# Altium project MPPT_Charger_NB_IoT.PrjPcb
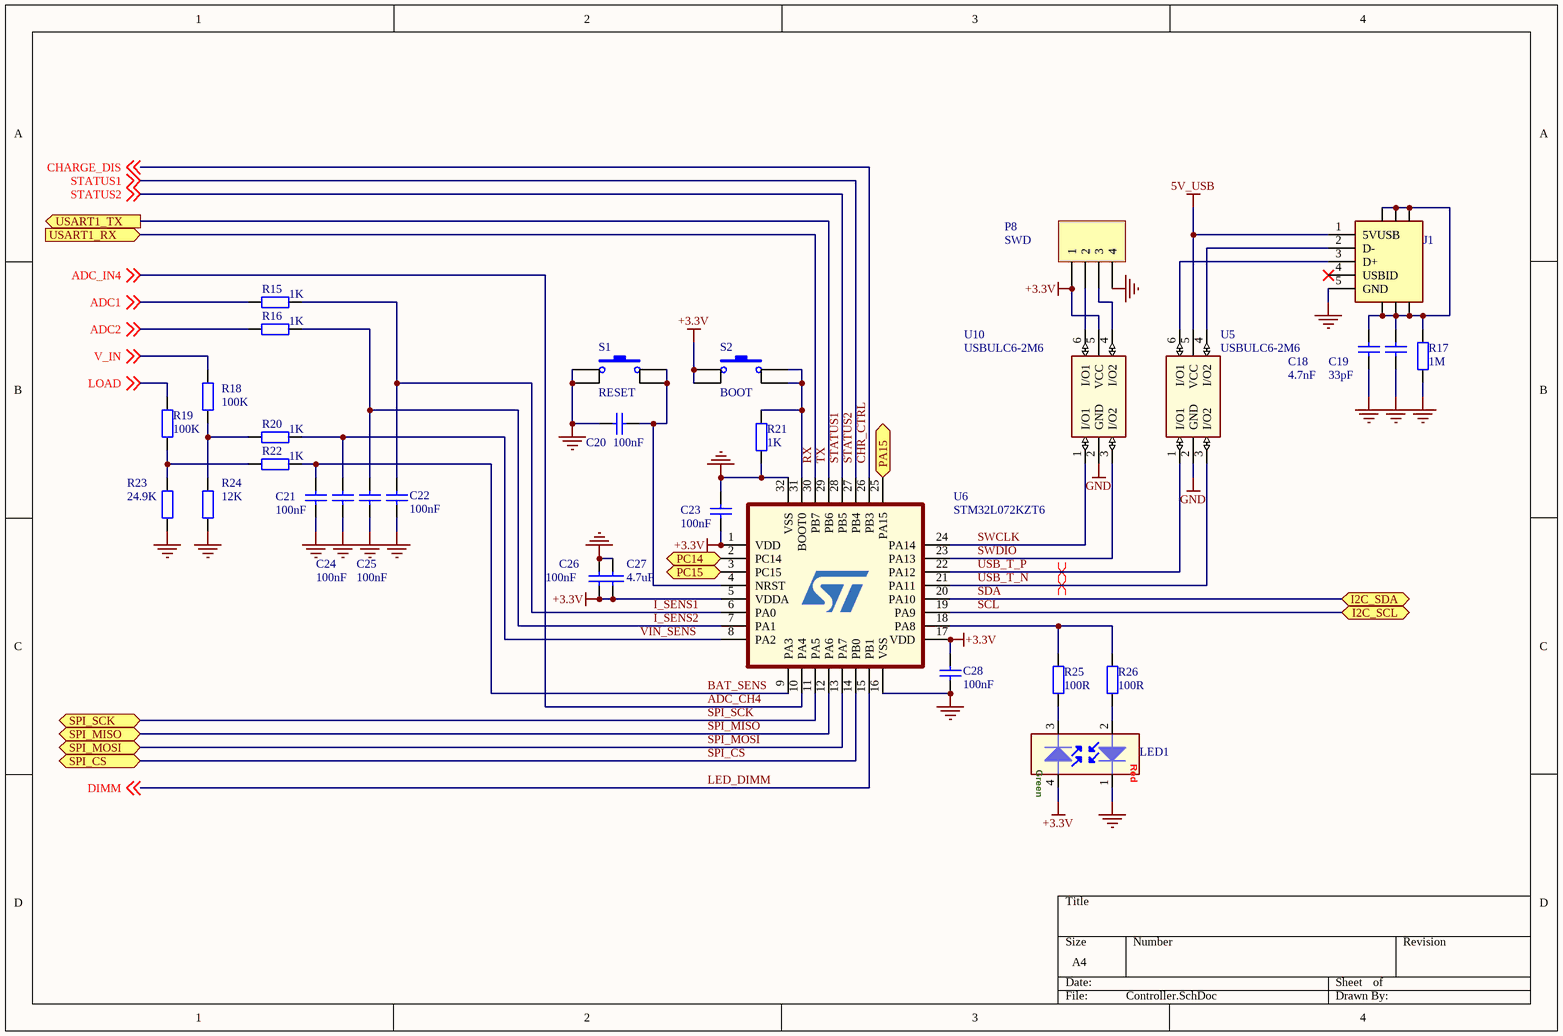
[diagram p0: Controller.SchDoc]
5 sheets, 113 parts. Net scope: flat (ports and power ports of the same name join across sheets).
Board file: MPPT_Charger.PcbDoc
Sheets:
  Controller.SchDoc
  Charger.SchDoc
  LED Driver.SchDoc
  Arduino.SchDoc
  Power.SchDoc

## Sheet Controller.SchDoc
size A4

### Parts
C18  value 4.7nF  [C0402]  (hidden comment: Capacitor ceramic)
C19  value 33pF  [C0402]  (hidden comment: Capacitor ceramic)
C20  value 100nF  [C0402]  (hidden comment: Capacitor ceramic)
C21  value 100nF  [C0402]  (hidden comment: Capacitor ceramic)
C22  value 100nF  [C0402]  (hidden comment: Capacitor ceramic)
C23  value 100nF  [C0402]  (hidden comment: Capacitor ceramic)
C24  value 100nF  [C0402]  (hidden comment: Capacitor ceramic)
C25  value 100nF  [C0402]  (hidden comment: Capacitor ceramic)
C26  value 100nF  [C0402]  (hidden comment: Capacitor ceramic)
C27  value 4.7uF  [C0805]  (hidden comment: Capacitor ceramic)
C28  value 100nF  [C0402]  (hidden comment: Capacitor ceramic)
J1  CON-000116-01  [10118192-0001LF]  (value not drawn)
LED1  LED_BICOLOR  [PLCC-4]  (value not drawn)
P8  SWD  [HDR1X4]  (no BOM)
R15  value 1K  [R0402]  (hidden comment: Resistor)
R16  value 1K  [R0402]  (hidden comment: Resistor)
R17  value 1M  [R0402]  (hidden comment: Resistor)
R18  value 100K  [R0402]  (hidden comment: Resistor)
R19  value 100K  [R0402]  (hidden comment: Resistor)
R20  value 1K  [R0402]  (hidden comment: Resistor)
R21  value 1K  [R0402]  (hidden comment: Resistor)
R22  value 1K  [R0402]  (hidden comment: Resistor)
R23  value 24.9K  [R0402]  (hidden comment: Resistor)
R24  value 12K  [R0402]  (hidden comment: Resistor)
R25  value 100R  [R0402]  (hidden comment: Resistor)
R26  value 100R  [R0402]  (hidden comment: Resistor)
S1  RESET  [EVQPUA]
S2  BOOT  [EVQPUA]
U5  USBULC6-2M6  [Micro_QFN_6L]
U6  STM32L072KZT6  [LQFP32]
U10  USBULC6-2M6  [Micro_QFN_6L]

### Ports
I2C_SCL (bidir), I2C_SDA (bidir), PA15 (bidir), PC14 (bidir), PC15 (bidir), SPI_CS (bidir), SPI_MISO (bidir), SPI_MOSI (bidir), SPI_SCK (bidir), USART1_RX (in), USART1_TX (out)

### Nets
5V_USB: J1.1(5VUSB) U5.5(VCC)
+3.3V: C23.2 C26.2 C27.1 C28.1 LED1.4 P8.1 S2.1 S2.3 U6.1(VDD) U6.5(VDDA) U6.17(VDD) U10.5(VCC)
GND: C18.1 C19.1 C20.2 C21.2 C22.2 C23.1 C24.2 C25.2 C26.1 C27.2 C28.2 J1.5(GND) LED1.1 P8.4 R17.1 R21.1 R23.2 R24.1 S1.1 S1.3 U5.2(GND) U6.16(VSS) U6.32(VSS) U10.2(GND)
V_IN: R18.2 ; off-sheet V_IN
ADC1: R15.1 ; off-sheet ADC1
ADC2: R16.1 ; off-sheet ADC2
ADC_CH4: U6.10(PA4) ; off-sheet ADC_IN4  [also labelled ADC_IN4]
BAT_SENS: C21.1 R22.2 U6.9(PA3)
CHR_CTRL: U6.26(PB3) ; off-sheet CHARGE_DIS  [also labelled CHARGE_DIS]
I_SENS1: C22.1 R15.2 U6.6(PA0)
I_SENS2: C25.1 R16.2 U6.7(PA1)
LED_DIMM: U6.15(PB1) ; off-sheet DIMM  [also labelled DIMM]
LOAD: R19.1 ; off-sheet LOAD  [project net SR_N]
RX: U6.30(PB7) ; port USART1_RX
SCL: U6.19(PA9) ; port I2C_SCL
SDA: U6.20(PA10) ; port I2C_SDA
SPI_CS: U6.14(PB0) ; port SPI_CS
SPI_MISO: U6.12(PA6) ; port SPI_MISO
SPI_MOSI: U6.13(PA7) ; port SPI_MOSI
SPI_SCK: U6.11(PA5) ; port SPI_SCK
STATUS1: U6.27(PB4) U6.28(PB5) ; off-sheet STATUS1, off-sheet STATUS2  [also labelled STATUS2]
SWCLK: U6.24(PA14) U10.1(I/O1)
SWDIO: U6.23(PA13) U10.3(I/O2)
TX: U6.29(PB6) ; port USART1_TX
USB_T_N: U5.3(I/O2) U6.21(PA11)
USB_T_P: U5.1(I/O1) U6.22(PA12)
VIN_SENS: C24.1 R20.2 U6.8(PA2)
NetC18_2: C18.2 C19.2 J1.6 J1.7 J1.8 J1.9 J1.10 J1.11 R17.2
NetC20_1: C20.1 S1.2 S1.4 U6.4(NRST)
NetJ1_2: J1.2(D-) U5.4(I/O2)
NetJ1_3: J1.3(D+) U5.6(I/O1)
NetLED1_2: LED1.2 R26.2
NetLED1_3: LED1.3 R25.2
NetP4_3: U6.25(PA15) ; port PA15
NetP4_4: U6.3(PC15) ; port PC15
NetP4_5: U6.2(PC14) ; port PC14
NetP8_2: P8.2 U10.6(I/O1)
NetP8_3: P8.3 U10.4(I/O2)
NetR18_1: R18.1 R20.1 R24.2
NetR19_2: R19.2 R22.1 R23.1
NetR21_2: R21.2 S2.2 S2.4 U6.31(BOOT0)
NetR25_1: R25.1 R26.1 U6.18(PA8)

Not connected (* = marked no-connect by the designer): J1 4(USBID)*

### Layout directives
differential pair: USB_T_N, USB_T_P

### Notes on the sheet
- (in symbol LED_BICOLOR) Red; Green

### Library data of the parts
C18 = Cap Semi: Manufacturer: Yageo; Manufacturer Part No.: AC0402KRX7R9BB472; Part Description: Ceramic Capacitor; Specification: X7R, 50V, 10%; Supplier: DigiKey; Supplier part number: 311-3030-1-ND; Link: https://www.digikey.com/product-detail/en/yageo/AC0402KRX7R9BB472/311-3030-1-ND/6643281
C19 = Cap Semi: Manufacturer: Yageo; Manufacturer Part No.: CC0402JRNPO9BN330; Part Description: Ceramic Capacitor; Specification: NP0, 50V, 5%; Supplier: DigiKey; Supplier part number: 311-1020-1-ND; Link: https://www.digikey.com/product-detail/en/yageo/CC0402JRNPO9BN330/311-1020-1-ND/302937
C20 = Cap Semi: Manufacturer: TDK Corporation; Manufacturer Part No.: CGA2B3X7R1V104K050BB; Part Description: Ceramic Capacitor; Specification: X7R, 35V, 10%; Supplier: DigiKey; Supplier part number: 445-6901-1-ND; Link: https://www.digikey.com/product-detail/en/tdk-corporation/CGA2B3X7R1V104K050BB/445-6901-1-ND/2672919
C21-C26 C28 = Cap: Manufacturer: TDK Corporation; Manufacturer Part No.: CGA2B3X7R1V104K050BB; Part Description: Ceramic Capacitor; Specification: X7R, 35V, 10%; Link: https://www.digikey.com/product-detail/en/tdk-corporation/CGA2B3X7R1V104K050BB/445-6901-1-ND/2672919; Supplier: DigiKey; Supplier part number: 445-6901-1-ND
C27 = Cap Semi: Manufacturer: Murata Electronics; Manufacturer Part No.: GRM219R6YA475KA73D; Part Description: Ceramic Capacitor; Specification: X5R, 35V, 10%; Supplier: DigiKey; Supplier part number: 490-7208-1-ND; Link: https://www.digikey.com/product-detail/en/murata-electronics/GRM219R6YA475KA73D/490-7208-1-ND/3900454
J1 = CON-000116-01: Manufacturer: Amphenol ICC (FCI); Part Description: Micro USB Connector; Specification: Type B; Value: 10118192-0001LF; Manufacturer Part No.: 10118192-0001LF; Supplier: DigiKey; Supplier part number: 609-4613-1-ND; Link: https://www.digikey.com/product-detail/en/amphenol-icc-fci/10118192-0001LF/609-4613-1-ND/2785378
LED1 = LED_BICOLOR: Manufacturer: OSRAM Opto Semiconductors Inc.; Manufacturer Part No.: LSG T67K-JL-1+HK-1; Part Description: BICOLOR LED RED/GREEN CLEAR; Specification: SMT; Value: LSG T67K-JL-1+HK-1; Link: https://www.digikey.com/product-detail/en/osram-opto-semiconductors-inc/LSG-T67K-JL-1-HK-1/475-3435-1-ND/7908051; Supplier: DigiKey; Supplier part number: 475-3435-1-ND
P8 = Header 4: Header, 4-Pin; Manufacturer: Samtec Inc.; Manufacturer Part No.: SLW-104-01-G-S; Part Description: Receptacle Connector Through Hole; Specification: 4 pos. 2.54mm; Value: SLW-104-01-G-S; Link: https://www.digikey.com/products/en?keywords=SLW-104-01-G-S; Supplier: DigiKey; Supplier part number: SAM1089-04-ND
R15 R16 R20-R22 = Res2: Manufacturer: Yageo; Manufacturer Part No.: AC0402JR-071KL; Part Description: Thick Film Resistor; Specification: 5% 0,063W; Link: https://www.digikey.com/product-detail/en/yageo/AC0402JR-071KL/YAG3525CT-ND/6006374; Supplier: DigiKey; Supplier part number: YAG3525CT-ND
R17 = Res2: Manufacturer: Yageo; Manufacturer Part No.: RC0402FR-071ML; Part Description: Thick Film Resistor; Specification: 1% 0,063W; Supplier: DigiKey; Supplier part number: 311-1.00MLRCT-ND; Link: https://www.digikey.com/product-detail/en/yageo/RC0402FR-071ML/311-1-00MLRCT-ND/729462
R18 R19 = Res2: Manufacturer: Yageo; Manufacturer Part No.: RC0402JR-07100KL; Part Description: Thick Film Resistor; Specification: 5% 0,063W; Link: https://www.digikey.com/product-detail/en/yageo/RC0402JR-07100KL/311-100KJRCT-ND/729363; Supplier: DigiKey; Supplier part number: 311-100KJRCT-ND
R23 = Res2: Manufacturer: Yageo; Manufacturer Part No.: RC0402FR-0724K9L; Part Description: Thick Film Resistor; Specification: 1% 0,063W; Link: https://www.digikey.com/product-detail/en/yageo/RC0402FR-0724K9L/311-24-9KLRCT-ND/729514; Supplier: DigiKey; Supplier part number: 311-24.9KLRCT-ND
R24 = Res2: Manufacturer: Yageo; Manufacturer Part No.: RC0402JR-0712KL; Part Description: Thick Film Resistor; Specification: 5% 0,063W; Link: https://www.digikey.com/product-detail/en/yageo/RC0402JR-0712KL/311-12KJRCT-ND/729370; Supplier: DigiKey; Supplier part number: 311-12KJRCT-ND
R25 R26 = Res2: Manufacturer: Yageo; Manufacturer Part No.: SR0402JR-7W100RL; Part Description: Thick Film Resistor; Specification: 5% 0.125W; Supplier: DigiKey; Supplier part number: YAG6156CT-ND; Link: https://www.digikey.com/product-detail/en/yageo/SR0402JR-7W100RL/YAG6156CT-ND/9696610
S1 S2 = SW-PB: Switch; Manufacturer: Panasonic; Manufacturer Part No.: EVQPUJ02K; Part Description: Tactile Button; Specification: 1.6N, Right Angle, 50mA; Value: EVQPUJ02K; Supplier: DigiKey; Supplier part number: P10851SCT-ND; Link: https://www.digikey.com/product-detail/en/panasonic-electronic-components/EVQ-PUJ02K/P10851SCT-ND/286352
U5 U10 = USBULC6-2M6: Ultra large bandwidth ESD protection; Manufacturer: STMicroelectronics; Specification: 6V, 0.6pF; Link: https://www.digikey.com/product-detail/en/stmicroelectronics/USBULC6-2M6/497-7044-1-ND/1880382; Manufacturer Part No.: USBULC6-2M6; Part Description: Ultra large bandwidth ESD protection; Supplier: DigiKey; Supplier part number: 497-7044-1-ND; Value: USBULC6-2M6
U6 = STM32L072KZT6: Ultra-low-power 32-bit MCU Arm®-based Cortex®-M0+; Manufacturer: STMicroelectronics; Specification: 192KB, 20KB, 1.65V-3.6V; Link: https://www.digikey.com/products/en?keywords=STM32L072KZT6; Manufacturer Part No.: STM32L072KZT6; Part Description: Ultra-low-power 32-bit MCU Arm®-based Cortex®-M0+; Supplier: DigiKey; Supplier part number: 497-19668-ND; Value: STM32L072KZT6

## Sheet Charger.SchDoc
size A4
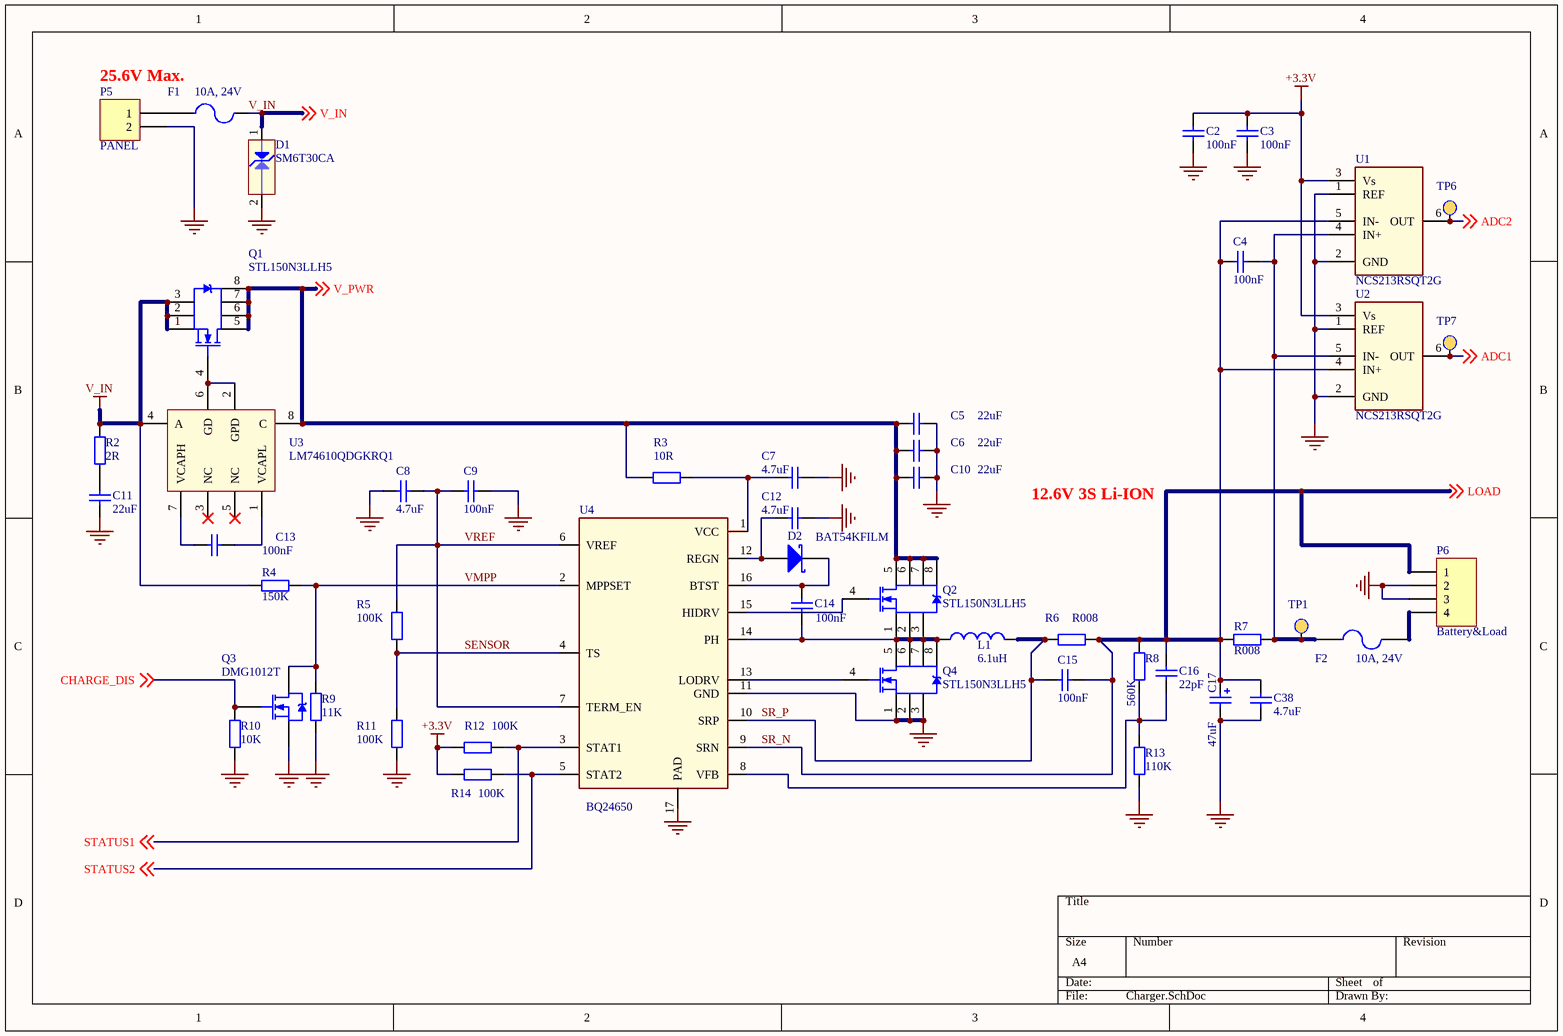
[diagram p1: Charger.SchDoc]

### Parts
C2  value 100nF  [C0402]  (hidden comment: Capacitor ceramic)
C3  value 100nF  [C0402]  (hidden comment: Capacitor ceramic)
C4  value 100nF  [C0402]  (hidden comment: Capacitor ceramic)
C5  value 22uF  [C1210]  (hidden comment: Capacitor ceramic)
C6  value 22uF  [C1210]  (hidden comment: Capacitor ceramic)
C7  value 4.7uF  [C0805]  (hidden comment: Capacitor ceramic)
C8  value 4.7uF  [C0805]  (hidden comment: Capacitor ceramic)
C9  value 100nF  [C0402]  (hidden comment: Capacitor ceramic)
C10  value 22uF  [C1210]  (hidden comment: Capacitor ceramic)
C11  value 22uF  [C1210]  (hidden comment: Capacitor ceramic)
C12  value 4.7uF  [C0805]  (hidden comment: Capacitor ceramic)
C13  value 100nF  [C0402]  (hidden comment: Capacitor ceramic)
C14  value 100nF  [C0402]  (hidden comment: Capacitor ceramic)
C15  value 100nF  [C0402]  (hidden comment: Capacitor ceramic)
C16  value 22pF  [C0402]  (hidden comment: Capacitor ceramic)
C17  value 47uF  [EIA-7343-31]  (hidden comment: Capacitor Tantalum)
C38  value 4.7uF  [C0805]  (hidden comment: Capacitor ceramic)
D1  SM6T30CA  [DO-214AA]
D2  BAT54KFILM  [SOD-523]
F1  10A, 24V  [F1206]
F2  10A, 24V  [F1206]
L1  value 6.1uH  [CDEP147]  (hidden comment: Power Inductor)
P5  PANEL  [TERM2pin5mm]
P6  Battery&Load  [TERM4pin5mm]
Q1  STL150N3LLH5  [PowerFLAT 5x6]
Q2  STL150N3LLH5  [PowerFLAT 5x6]
Q3  DMG1012T  [SOT-523_custom]
Q4  STL150N3LLH5  [PowerFLAT 5x6]
R2  value 2R  [R0805]  (hidden comment: Resistor)
R3  value 10R  [R0805]  (hidden comment: Resistor)
R4  value 150K  [R0402]  (hidden comment: Resistor)
R5  value 100K  [R0402]  (hidden comment: Resistor)
R6  value R008  [R2010]  (hidden comment: Resistor)
R7  value R008  [R2010]  (hidden comment: Resistor)
R8  value 560K  [R0402]  (hidden comment: Resistor)
R9  value 11K  [R0402]  (hidden comment: Resistor)
R10  value 10K  [R0402]  (hidden comment: Resistor)
R11  value 100K  [R0402]  (hidden comment: Resistor)
R12  value 100K  [R0402]  (hidden comment: Resistor)
R13  value 110K  [R0402]  (hidden comment: Resistor)
R14  value 100K  [R0402]  (hidden comment: Resistor)
TP1  Test_Point  [TEST_POINT]  (value not drawn)  (no BOM)
TP6  Test_Point  [TEST_POINT]  (value not drawn)  (no BOM)
TP7  Test_Point  [TEST_POINT]  (value not drawn)  (no BOM)
U1  NCS213RSQT2G  [SOT-363]
U2  NCS213RSQT2G  [SOT-363]
U3  LM74610QDGKRQ1  [TSSOP-8]
U4  BQ24650  [QFN-16_custom]

### Nets
+3.3V: C2.1 C3.1 R12.1 R14.1 U1.3(Vs) U2.3(Vs)
GND: C2.2 C3.2 C5.1 C6.1 C7.1 C8.1 C9.1 C10.1 C11.2 C12.1 C17.2 C38.2 D1.2(PIN2) P5.2 P6.2 P6.3 Q3.3(S) Q4.1(S) Q4.2(S) Q4.3(S) R9.1 R10.1 R11.1 R13.1 U1.1(REF) U1.2(GND) U2.1(REF) U2.2(GND) U4.11(GND) U4.17(PAD)
V_IN: D1.1(PIN1) F1.2 Q1.1(S) Q1.2(S) Q1.3(S) R2.2 R4.2 U3.4(A) ; off-sheet V_IN
ADC1: TP7.0 U2.6(OUT) ; off-sheet ADC1
ADC2: TP6.0 U1.6(OUT) ; off-sheet ADC2
CHARGE_DIS: Q3.1(G) R10.2 ; off-sheet CHARGE_DIS  [project net CHR_CTRL]
SENSOR: R5.1 R11.2 U4.4(TS)
SR_N: C4.2 C15.1 C16.1 C17.1 C38.1 P6.1 R6.2 R7.2 R8.2 U1.5(IN-) U2.4(IN+) U4.9(SRN) ; off-sheet LOAD  [also labelled LOAD]
SR_P: C15.2 L1.2 R6.1 U4.10(SRP)
STATUS1: R12.2 R14.2 U4.3(STAT1) U4.5(STAT2) ; off-sheet STATUS1, off-sheet STATUS2  [also labelled STATUS2]
V_PWR: C5.2 C6.2 C10.2 Q1.5(D) Q1.6(D) Q1.7(D) Q1.8(D) Q2.5(D) Q2.6(D) Q2.7(D) Q2.8(D) R3.1 U3.8(C) ; off-sheet V_PWR
VMPP: Q3.2(D) R4.1 R9.2 U4.2(MPPSET)
VREF: C8.2 C9.2 R5.2 U4.6(VREF) U4.7(TERM_EN)
NetC4_1: C4.1 F2.1 R7.1 TP1.0 U1.4(IN+) U2.5(IN-)
NetC7_2: C7.2 R3.2 U4.1(VCC)
NetC11_1: C11.1 R2.1
NetC12_2: C12.2 D2.1(A) U4.12(REGN)
NetC13_1: C13.1 U3.7(VCAPH)
NetC13_2: C13.2 U3.1(VCAPL)
NetC14_1: C14.1 D2.2(K) U4.16(BTST)
NetC14_2: C14.2 L1.1 Q2.1(S) Q2.2(S) Q2.3(S) Q4.5(D) Q4.6(D) Q4.7(D) Q4.8(D) U4.14(PH)
NetC16_2: C16.2 R8.1 R13.2 U4.8(VFB)
NetF1_1: F1.1 P5.1
NetF2_2: F2.2 P6.4
NetQ1_4: Q1.4(G) U3.2(GPD) U3.6(GD)
NetQ2_4: Q2.4(G) U4.15(HIDRV)
NetQ4_4: Q4.4(G) U4.13(LODRV)

Not connected (* = marked no-connect by the designer): U3 3(NC)* 5(NC)*

### Notes on the sheet
- 25.6V Max.
- 12.6V 3S Li-ION

### Library data of the parts
C2-C4 C9 C13-C15 = Cap: as C21 on sheet Controller; Link: https://www.digikey.com/product-detail/en/tdk-corporation/CGA2B3X7R1V104K050BB/445-6901-1-ND/2672919; Supplier: DigiKey; Supplier part number: 445-6901-1-ND
C5 C6 C10 C11 = Cap: Manufacturer: Taiyo Yuden; Manufacturer Part No.: GMK325BJ226MM-P; Part Description: Ceramic Capacitor; Specification: X5R, 35V, 20%; Link: https://www.digikey.com/product-detail/en/taiyo-yuden/GMK325BJ226MM-P/587-5853-1-ND/7674973; Supplier: DigiKey; Supplier part number: 587-5853-1-ND
C7 C8 C12 C38 = Cap: Manufacturer: Murata Electronics; Manufacturer Part No.: GRM219R6YA475KA73D; Part Description: Ceramic Capacitor; Specification: X5R, 35V, 10%; Link: https://www.digikey.com/product-detail/en/murata-electronics/GRM219R6YA475KA73D/490-7208-1-ND/3900454; Supplier: DigiKey; Supplier part number: 490-7208-1-ND
C16 = Cap: Manufacturer: Yageo; Manufacturer Part No.: CC0402JRNPO9BN220; Part Description: Ceramic Capacitor; Specification: NPO, 50V, 5%; Link: https://www.digikey.com/product-detail/en/yageo/CC0402JRNPO9BN220/311-1018-1-ND/302935; Supplier: DigiKey; Supplier part number: 311-1018-1-ND
C17 = Cap Pol2: Manufacturer: AVX Corporation; Manufacturer Part No.: TAJD476K016RNJ; Specification: TANT, 16V, 10%; Link: https://www.digikey.com/product-detail/en/avx-corporation/TAJD476K016RNJ/478-1739-1-ND/564771; Part Description: Capacitor Tantalum; Supplier: DigiKey; Supplier part number: 478-1739-1-ND
D1 = ESD_Diode: ESD Diode Symbol; Manufacturer: STMicroelectronics; Manufacturer Part No.: SM6T30CAY; Part Description: TVS DIODE; Specification: 30V, 0.6kW; Value: SM6T30CAY; Link: https://www.digikey.com/product-detail/en/stmicroelectronics/SM6T30CAY/497-10800-1-ND/2442951; Supplier: DigiKey; Supplier part number: 497-10800-1-ND
D2 = D Schottky: Schottky Diode; Manufacturer: STMicroelectronics; Part Description: Small signal Schottky diode; Specification: 40V, 0.3A; Manufacturer Part No.: BAT54KFILM; Supplier: DigiKey; Supplier part number: 497-5561-1-ND; Value: BAT54KFILM; Link: https://www.digikey.com/product-detail/en/stmicroelectronics/BAT54KFILM/497-5561-1-ND/1207053
F1 F2 = Fuse 2: SMD Fuse; Manufacturer: LITTELFUSE; Part Description: Fast Acting  Fuse; Value: 1206SFH100F/24-2; Specification: 100A; Link: https://uk.farnell.com/littelfuse/1206sfh100f-24-2/fuse-1206-10a/dp/1832124; Manufacturer Part No.: 1206SFH100F/24-2; Supplier: Farnell; Supplier part number: 1832124
L1 = Inductor: Manufacturer: Sumida America Components Inc.; Manufacturer Part No.: CDEP147NP-6R1MC-95; Specification: 11A, 20%; Link: https://www.digikey.com/product-detail/en/sumida-america-components-inc/CDEP147NP-6R1MC-95/308-1608-1-ND/3232383; Part Description: Power Inductor; Supplier: DigiKey; Supplier part number: 308-1608-1-ND
P5 = Header 2: Header, 2-Pin; Manufacturer: SAURO; Part Description: Terminal block; Value: MSG02001; Specification: 2pos. 5mm,  24A, 300V; Link: https://www.sauro.net/products/MSG02001/?product_id=MSG02001; Manufacturer Part No.: MSG02001; Supplier: Rutronik; Supplier part number: COTERM5720
P6 = Header 4: Header, 4-Pin; Manufacturer: SAURO; Manufacturer Part No.: MSG04001; Part Description: Terminal block; Specification: 4 pos. 5mm,  24A, 300V; Value: MSG04001; Link: https://www.sauro.net/products/MSG04001/?product_id=MSG04001; Supplier: Rutronik; Supplier part number: COTERM6351
Q1 Q2 Q4 = STL150N3LLH5: Power MOSFET N-channel; Manufacturer: STMicroelectronics; Part Description: P-channel Power MOSFET; Specification: 30V, 35A; Manufacturer Part No.: STL150N3LLH5; Supplier: Farnell; Supplier part number: 1752112RL; Value: STL150N3LLH5; Link: https://uk.farnell.com/stmicroelectronics/stl150n3llh5/mosfet-n-ch-30v-35a-powerflat6x5/dp/1752112RL
Q3 = NMOS-2: N-Channel Power MOSFET; Manufacturer: Diodes Incorporated; Manufacturer Part No.: DMG1012T-7; Part Description: N-Channel MOSFET; Specification: 20V, 0.63A; Value: DMG1012T-7; Supplier: DigiKey; Supplier part number: DMG1012T-7DICT-ND; Link: https://www.digikey.com/product-detail/en/diodes-incorporated/DMG1012T-7/DMG1012T-7DICT-ND/2181232
R2 = Res2: Manufacturer: Yageo; Manufacturer Part No.: RC0805JR-072RL; Part Description: Thick Film Resistor; Specification: 5% 0.125W; Link: https://www.digikey.com/product-detail/en/yageo/RC0805JR-072RL/311-2-0ARCT-ND/731214; Supplier: DigiKey; Supplier part number: 311-2.0ARCT-ND
R3 = Res2: Manufacturer: Yageo; Manufacturer Part No.: RC0805JR-07510RL; Part Description: Thick Film Resistor; Specification: 5% 0.125W; Link: https://www.digikey.com/product-detail/en/yageo/RC0805JR-07510RL/311-510ARCT-ND/731290; Supplier: DigiKey; Supplier part number: 311-510ARCT-ND
R4 = Res2: Manufacturer: Yageo; Manufacturer Part No.: RC0402JR-07150KL; Part Description: Thick Film Resistor; Specification: 5% 0,063W; Link: https://www.digikey.com/product-detail/en/yageo/RC0402JR-07150KL/311-150KJRCT-ND/729372; Supplier: DigiKey; Supplier part number: 311-150KJRCT-ND
R5 R11 R12 R14 = Res2: as R18 on sheet Controller; Link: https://www.digikey.com/product-detail/en/yageo/RC0402JR-07100KL/311-100KJRCT-ND/729363; Supplier: DigiKey; Supplier part number: 311-100KJRCT-ND
R6 R7 = Res2: Manufacturer: Rohm Semiconductor; Manufacturer Part No.: PMR50HZPFU8L00; Part Description: Thick Film Resistor; Specification: 1% 1W; Link: https://www.digikey.com/product-detail/en/rohm-semiconductor/PMR50HZPFU8L00/RHM-008ASCT-ND/2094542; Supplier: DigiKey; Supplier part number: RHM.008ASCT-ND
R8 = Res2: Manufacturer: Yageo; Manufacturer Part No.: RC0402JR-07560KL; Part Description: Thick Film Resistor; Specification: 5% 0,063W; Link: https://www.digikey.com/product-detail/en/yageo/RC0402JR-07560KL/311-560KJRCT-ND/729440; Supplier: DigiKey; Supplier part number: 311-560KJRCT-ND
R9 = Res2: Manufacturer: Yageo; Manufacturer Part No.: RC0402JR-0711KL; Part Description: Thick Film Resistor; Specification: 5% 0,063W; Link: https://www.digikey.com/product-detail/en/yageo/RC0402JR-0711KL/311-11KJRCT-ND/729367; Supplier: DigiKey; Supplier part number: 311-11KJRCT-ND
R10 = Res2: Manufacturer: Yageo; Manufacturer Part No.: RC0100JR-0710KL; Part Description: Thick Film Resistor; Specification: 5% 0.03W; Link: https://www.digikey.com/product-detail/en/yageo/RC0100JR-0710KL/311-10KDHCT-ND/2254412; Supplier: DigiKey; Supplier part number: 311-10KDHCT-ND
R13 = Res2: Manufacturer: Yageo; Manufacturer Part No.: RC0402JR-07110KL; Part Description: Thick Film Resistor; Specification: 5% 0,063W; Link: https://www.digikey.com/product-detail/en/yageo/RC0402JR-07110KL/311-110KJRCT-ND/729366; Supplier: DigiKey; Supplier part number: 311-110KJRCT-ND
TP1 TP6 TP7 = Test_Point: Test Point
U1 U2 = NCS21xR: Current-Shunt Monitor; Manufacturer: ON Semiconductor; Specification: x50, 80uA, 26V; Link: https://www.digikey.com/product-detail/en/on-semiconductor/NCS213RSQT2G/NCS213RSQT2GOSCT-ND/9169239; Manufacturer Part No.: NCS213RSQT2G; Part Description: Current-Shunt Monitor; Supplier: DigiKey; Supplier part number: NCS213RSQT2GOSCT-ND; Value: NCS213RSQT2G
U3 = LM74610-Q1: Smart Diode Controller; Manufacturer: TI; Specification: 42V, 30uA; Link: https://www.digikey.com/product-detail/en/texas-instruments/LM74610QDGKRQ1/296-43067-1-ND/5722225; Manufacturer Part No.: LM74610QDGKRQ1; Part Description: Smart Diode Controller; Supplier: DigiKey; Supplier part number: 296-43067-1-ND; Value: LM74610QDGKRQ1
U4 = BQ24650: Maximum Power Point Charger; Manufacturer: TI; Manufacturer Part No.: BQ24650RVAR; Part Description: Battery Charge Controller; Value: BQ24650RVAT; Specification: 28V, MPPT; Link: https://www.digikey.com/product-detail/en/texas-instruments/BQ24650RVAR/296-46287-1-ND/7033462; Supplier: DigiKey; Supplier part number: 296-46287-1-ND

## Sheet LED Driver.SchDoc
size A4
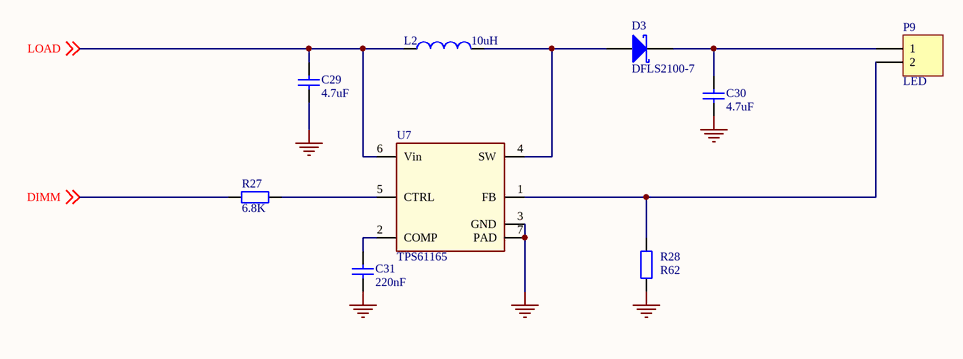
[diagram p2: LED Driver.SchDoc]

### Parts
C29  value 4.7uF  [C0805]  (hidden comment: Capacitor ceramic)
C30  value 4.7uF  [C0805]  (hidden comment: Capacitor ceramic)
C31  value 220nF  [C0402]  (hidden comment: Capacitor ceramic)
D3  DFLS2100-7  [PowerDI123]
L2  value 10uH  [LQH3NP]  (hidden comment: Power Inductor)
P9  LED  [TERM2pin5mm]
R27  value 6.8K  [R0402]  (hidden comment: Resistor)
R28  value R62  [R1206]  (hidden comment: Resistor)
U7  TPS61165  [QFN-6_custom]

### Nets
GND: C29.2 C30.2 C31.2 R28.1 U7.3(GND) U7.7(PAD)
DIMM: R27.1 ; off-sheet DIMM  [project net LED_DIMM]
LOAD: C29.1 L2.1 U7.6(Vin) ; off-sheet LOAD  [project net SR_N]
NetC30_1: C30.1 D3.2(K) P9.1
NetC31_1: C31.1 U7.2(COMP)
NetD3_1: D3.1(A) L2.2 U7.4(SW)
NetP9_2: P9.2 R28.2 U7.1(FB)
NetR27_2: R27.2 U7.5(CTRL)

### Library data of the parts
C29 C30 = Cap: as C7 on sheet Charger; Link: https://www.digikey.com/product-detail/en/murata-electronics/GRM219R6YA475KA73D/490-7208-1-ND/3900454; Supplier: DigiKey; Supplier part number: 490-7208-1-ND
C31 = Cap: Manufacturer: Yageo; Manufacturer Part No.: CC0402KRX5R8BB224; Part Description: Ceramic Capacitor; Specification: X5R, 25V, 10%; Link: https://www.digikey.com/product-detail/en/yageo/CC0402KRX5R8BB224/311-3341-1-ND/6818311; Supplier: DigiKey; Supplier part number: 311-3341-1-ND
D3 = D Schottky: Schottky Diode; Manufacturer: Diodes Incorporated; Part Description: DIODE SCHOTTKY; Specification: 100V, 2A; Link: https://www.digikey.com/product-detail/en/diodes-incorporated/DFLS2100-7/DFLS2100-7DICT-ND/3451552; Value: DFLS2100-7; Manufacturer Part No.: DFLS2100-7; Supplier: DigiKey; Supplier part number: DFLS2100-7DICT-ND
L2 = Inductor: Manufacturer: Murata Electronics; Manufacturer Part No.: LQH3NPN100MMEL; Specification: 0.8A, 20%; Link: https://www.digikey.com/product-detail/en/murata-electronics/LQH3NPN100MMEL/490-15945-1-ND/6800610; Part Description: Power Inductor; Supplier: DigiKey; Supplier part number: 490-15945-1-ND
P9 = Header 2: as P5 on sheet Charger; Link: https://www.sauro.net/products/MSG02001/?product_id=MSG02001; Manufacturer Part No.: MSG02001; Supplier: Rutronik; Supplier part number: COTERM5720
R27 = Res2: Manufacturer: Yageo; Manufacturer Part No.: RC0402JR-076K8L; Part Description: Thick Film Resistor; Specification: 5% 0,063W; Link: https://www.digikey.com/product-detail/en/yageo/RC0402JR-076K8L/311-6-8KJRCT-ND/729444; Supplier: DigiKey; Supplier part number: 311-6.8KJRCT-ND
R28 = Res2: Manufacturer: Panasonic Electronic Components; Manufacturer Part No.: ERJ-8RQFR62V; Part Description: Thick Film Resistor; Specification: 1% 0.25W; Link: https://www.digikey.com/product-detail/en/panasonic-electronic-components/ERJ-8RQFR62V/P-62RCT-ND/3982353; Supplier: DigiKey; Supplier part number: P.62RCT-ND
U7 = TPS61165: HBLED Driver; Manufacturer: TI; Part Description: Boost LED DRiver; Value: TPS61165DRVT; Specification: 18V in, 38V, 350mA; Link: https://www.digikey.com/product-detail/en/texas-instruments/TPS61165DRVT/296-27015-1-ND/2255302; Manufacturer Part No.: TPS61165DRVT; Supplier: DigiKey; Supplier part number: 296-27015-1-ND

## Sheet Arduino.SchDoc
size A4
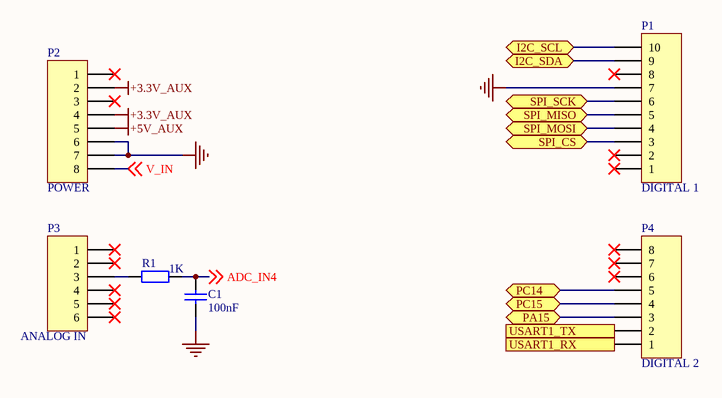
[diagram p3: Arduino.SchDoc]

### Parts
C1  value 100nF  [C0402]  (hidden comment: Capacitor ceramic)
P1  DIGITAL 1  [HDR1X10]
P2  POWER  [HDR1X8]  (no BOM)
P3  ANALOG IN  [HDR1X6]  (no BOM)
P4  DIGITAL 2  [HDR1X8]  (no BOM)
R1  value 1K  [R0402]  (hidden comment: Resistor)

### Ports
I2C_SCL (bidir), I2C_SDA (bidir), PA15 (bidir), PC14 (bidir), PC15 (bidir), SPI_CS (bidir), SPI_MISO (bidir), SPI_MOSI (bidir), SPI_SCK (bidir), USART1_RX (out), USART1_TX (in)

### Nets
+3.3V_AUX: P2.2 P2.4
+5V_AUX: P2.5
GND: C1.2 P1.7 P2.6 P2.7
V_IN: P2.8 ; off-sheet V_IN
ADC_IN4: C1.1 R1.2 ; off-sheet ADC_IN4  [project net ADC_CH4]
RX: P4.1 ; port USART1_RX
SCL: P1.10 ; port I2C_SCL
SDA: P1.9 ; port I2C_SDA
SPI_CS: P1.3 ; port SPI_CS
SPI_MISO: P1.5 ; port SPI_MISO
SPI_MOSI: P1.4 ; port SPI_MOSI
SPI_SCK: P1.6 ; port SPI_SCK
TX: P4.2 ; port USART1_TX
NetP3_3: P3.3 R1.1
NetP4_3: P4.3 ; port PA15
NetP4_4: P4.4 ; port PC15
NetP4_5: P4.5 ; port PC14

Not connected (* = marked no-connect by the designer): P1 1* 2* 8*; P2 1* 3*; P3 1* 2* 4* 5* 6*; P4 6* 7* 8*

### Library data of the parts
C1 = Cap: as C21 on sheet Controller; Link: https://www.digikey.com/product-detail/en/tdk-corporation/CGA2B3X7R1V104K050BB/445-6901-1-ND/2672919; Supplier: DigiKey; Supplier part number: 445-6901-1-ND
P1 = Header 10: Manufacturer: SparkFun Electronics; Manufacturer Part No.: PRT-11417; Part Description: ARDUINO STACKABLE HEADER KIT - R; Specification: 10 pos. 2,54mm; Value: PRT-11417; Supplier: DigiKey; Supplier part number: 1568-1413-ND; Link: https://www.digikey.com/product-detail/en/sparkfun-electronics/PRT-11417/1568-1413-ND/6161755
P2 P4 = Header 8: Manufacturer: ADAM TECH; Manufacturer Part No.: RS1-08-G; Part Description: Arduino Connector; Specification: 8 pos. 2,54mm; Value: RS1-08-G; Supplier: Rutronik; Supplier part number: CONN2043; Link: http://www.adam-tech.com/products.php
P3 = Header 6: Manufacturer: ADAM TECH; Manufacturer Part No.: RS1-06-G; Part Description: Arduino Connector; Specification: 6 pos. 2,54mm; Value: RS1-06-G; Supplier: Rutronik; Supplier part number: CONN2042; Link: http://www.adam-tech.com/products.php
R1 = Res2: as R15 on sheet Controller; Link: https://www.digikey.com/product-detail/en/yageo/AC0402JR-071KL/YAG3525CT-ND/6006374; Supplier: DigiKey; Supplier part number: YAG3525CT-ND

## Sheet Power.SchDoc
size A4
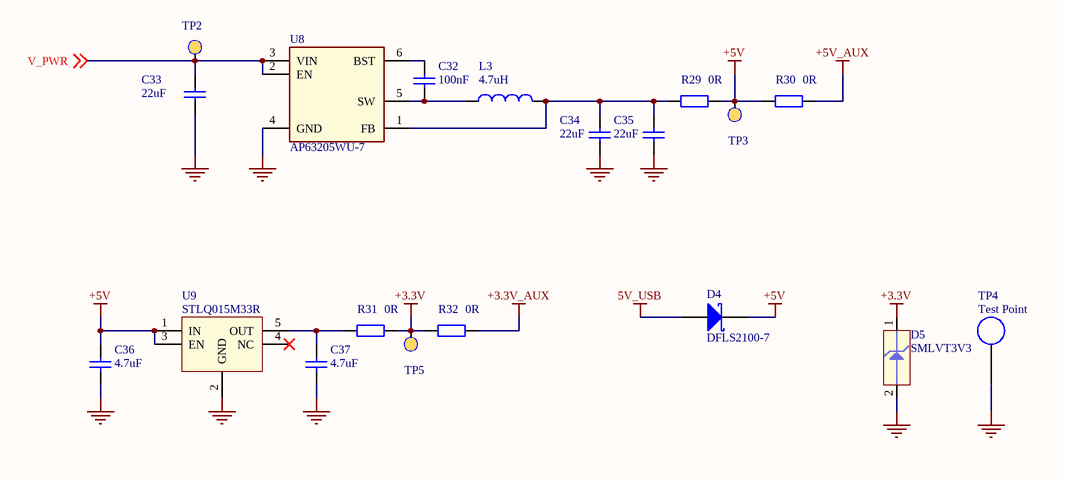
[diagram p4: Power.SchDoc]

### Parts
C32  value 100nF  [C0402]  (hidden comment: Capacitor ceramic)
C33  value 22uF  [C1210]  (hidden comment: Capacitor ceramic)
C34  value 22uF  [C1210]  (hidden comment: Capacitor ceramic)
C35  value 22uF  [C1210]  (hidden comment: Capacitor ceramic)
C36  value 4.7uF  [C0805]  (hidden comment: Capacitor ceramic)
C37  value 4.7uF  [C0805]  (hidden comment: Capacitor ceramic)
D4  DFLS2100-7  [PowerDI123]
D5  SMLVT3V3  [DO-214AA]
L3  value 4.7uH  [LQH3NP]  (hidden comment: Power Inductor)
R29  value 0R  [R1206]  (hidden comment: Resistor)
R30  value 0R  [R1206]  (hidden comment: Resistor)
R31  value 0R  [R1206]  (hidden comment: Resistor)
R32  value 0R  [R1206]  (hidden comment: Resistor)
TP2  Test_Point  [TEST_POINT]  (value not drawn)  (no BOM)
TP3  Test_Point  [TEST_POINT]  (value not drawn)  (no BOM)
TP4  Test Point  [5019_keystone]
TP5  Test_Point  [TEST_POINT]  (value not drawn)  (no BOM)
U8  AP63205WU-7  [SOT23-6_custom]
U9  STLQ015M33R  [SOT23-5L]

### Nets
5V_USB: D4.1(A)
+3.3V: D5.1(PIN1) R31.1 R32.2 TP5.0
+3.3V_AUX: R32.1
+5V: C36.2 D4.2(K) R29.1 R30.2 TP3.0 U9.1(IN) U9.3(EN)
+5V_AUX: R30.1
GND: C33.1 C34.1 C35.1 C36.1 C37.1 D5.2(PIN2) TP4.1 U8.4(GND) U9.2(GND)
V_PWR: C33.2 TP2.0 U8.2(EN) U8.3(VIN) ; off-sheet V_PWR
NetC32_1: C32.1 L3.1 U8.5(SW)
NetC32_2: C32.2 U8.6(BST)
NetC34_2: C34.2 C35.2 L3.2 R29.2 U8.1(FB)
NetC37_2: C37.2 R31.2 U9.5(OUT)

Not connected (* = marked no-connect by the designer): U9 4(NC)*

### Library data of the parts
C32 = Cap Semi: as C20 on sheet Controller; Supplier: DigiKey; Supplier part number: 445-6901-1-ND; Link: https://www.digikey.com/product-detail/en/tdk-corporation/CGA2B3X7R1V104K050BB/445-6901-1-ND/2672919
C33-C35 = Cap Semi: Manufacturer: Taiyo Yuden; Manufacturer Part No.: GMK325BJ226MM-P; Part Description: Ceramic Capacitor; Specification: X5R, 35V, 20%; Supplier: DigiKey; Supplier part number: 587-5853-1-ND; Link: https://www.digikey.com/product-detail/en/taiyo-yuden/GMK325BJ226MM-P/587-5853-1-ND/7674973
C36 C37 = Cap Semi: as C27 on sheet Controller; Supplier: DigiKey; Supplier part number: 490-7208-1-ND; Link: https://www.digikey.com/product-detail/en/murata-electronics/GRM219R6YA475KA73D/490-7208-1-ND/3900454
D4 = D Schottky: as D3 on sheet LED Driver; Link: https://www.digikey.com/product-detail/en/diodes-incorporated/DFLS2100-7/DFLS2100-7DICT-ND/3451552; Value: DFLS2100-7; Manufacturer Part No.: DFLS2100-7; Supplier: DigiKey; Supplier part number: DFLS2100-7DICT-ND
D5 = ESD_Diode: ESD Diode Symbol; Manufacturer: STMicroelectronics; Part Description: Low voltage Transil™; Specification: 3.3V, 0.6kW; Link: https://www.digikey.com/product-detail/en/stmicroelectronics/SMLVT3V3/497-2496-1-ND/603878; Manufacturer Part No.: SMLVT3V3; Supplier: DigiKey; Supplier part number: 497-2496-1-ND; Value: SMLVT3V3
L3 = Inductor: Manufacturer: Murata Electronics; Manufacturer Part No.: LQH3NPN4R7MMEL; Specification: 1A, 20%; Supplier: DigiKey; Supplier part number: 490-15954-1-ND; Part Description: Power Inductor; Link: https://www.digikey.com/product-detail/en/murata-electronics/LQH3NPN4R7MMEL/490-15954-1-ND/6800619
R29-R32 = Res2: Manufacturer: Yageo; Manufacturer Part No.: RC1206JR-070RL; Part Description: Thick Film Resistor; Specification: 0.25W; Supplier: DigiKey; Supplier part number: 311-0.0ERDKR-ND; Link: https://www.digikey.com/product-detail/en/yageo/RC1206JR-070RL/311-0-0ERDKR-ND/735078
TP2 TP3 TP5 = Test_Point: Test Point
TP4 = 5019: SMD Test Point; Manufacturer: Keystone Electronics; Part Description: SMT Test Point; Specification: 3.81*2.03; Value: 5019; Manufacturer Part No.: 5019; Supplier: DigiKey; Supplier part number: 36-5019CT-ND; Link: https://www.digikey.com/product-detail/en/keystone-electronics/5019/36-5019CT-ND/3907344
U8 = AP63205WU-7: SYNCHRONOUS BUCK WITH ENHANCED EMI REDUCTION; Manufacturer: Diodes Incorporated; Part Description: Buck Switching Regulator; Specification: 32V in, 5V, 2A; Link: https://www.digikey.com/product-detail/en/diodes-incorporated/AP63205WU-7/AP63205WU-7DICT-ND/9858428; Manufacturer Part No.: AP63205WU-7; Supplier: DigiKey; Supplier part number: AP63205WU-7DICT-ND; Value: AP63205WU-7
U9 = STLQ015M33R: Ultra low quiescent current linear voltage regulator; Manufacturer: STMicroelectronics; Specification: 5.5V in, 3.3V, 150mA; Link: https://www.digikey.com/product-detail/en/stmicroelectronics/STLQ015M33R/497-15934-1-ND/5398723; Manufacturer Part No.: STLQ015M33R; Part Description: Linear Voltage Regulator; Supplier: DigiKey; Supplier part number: 497-15934-1-ND; Value: STLQ015M33R

## Nets that join several sheets
5V_USB: Controller (J1.1 U5.5), Power (D4.1)
+3.3V: Controller (12 pins), Charger (6 pins), Power (D5.1 R31.1 R32.2 TP5.0)
+3.3V_AUX: Arduino (P2.2 P2.4), Power (R32.1)
+5V_AUX: Arduino (P2.5), Power (R30.1)
GND: Controller (24 pins), Charger (30 pins), LED Driver (6 pins), Arduino (C1.2 P1.7 P2.6 P2.7), Power (9 pins)
V_IN: Controller (R18.2), Charger (8 pins), Arduino (P2.8)
ADC1: Controller (R15.1), Charger (TP7.0 U2.6)
ADC2: Controller (R16.1), Charger (TP6.0 U1.6)
ADC_CH4: Controller (U6.10), Arduino (C1.1 R1.2)
CHR_CTRL: Controller (U6.26), Charger (Q3.1 R10.2)
LED_DIMM: Controller (U6.15), LED Driver (R27.1)
NetP4_3: Controller (U6.25), Arduino (P4.3)
NetP4_4: Controller (U6.3), Arduino (P4.4)
NetP4_5: Controller (U6.2), Arduino (P4.5)
RX: Controller (U6.30), Arduino (P4.1)
SCL: Controller (U6.19), Arduino (P1.10)
SDA: Controller (U6.20), Arduino (P1.9)
SPI_CS: Controller (U6.14), Arduino (P1.3)
SPI_MISO: Controller (U6.12), Arduino (P1.5)
SPI_MOSI: Controller (U6.13), Arduino (P1.4)
SPI_SCK: Controller (U6.11), Arduino (P1.6)
SR_N: Controller (R19.1), Charger (12 pins), LED Driver (C29.1 L2.1 U7.6)
STATUS1: Controller (U6.27 U6.28), Charger (R12.2 R14.2 U4.3 U4.5)
TX: Controller (U6.29), Arduino (P4.2)
V_PWR: Charger (13 pins), Power (C33.2 TP2.0 U8.2 U8.3)